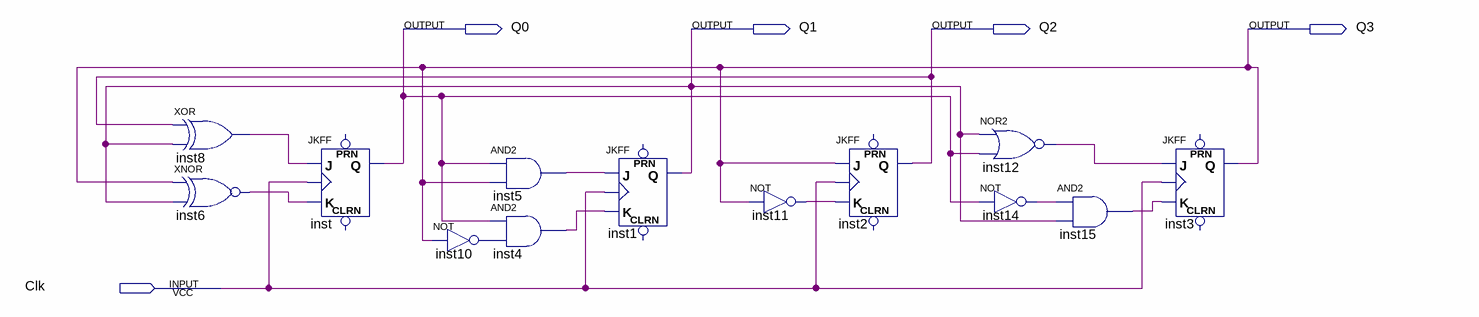
[diagram p0: schematic sheet]
// Quartus schematic Counter.bdf as structural Verilog: 13 symbols, 5 pins
module Counter (
  input  Clk,
  output Q0,
  output Q1,
  output Q2,
  output Q3
);

  wire inst4_out, inst5_out, inst6_out, inst8_out, inst10_out, inst11_out, inst12_out, inst14_out, inst15_out;

  xor inst8 (inst8_out, Q2, Q1);
  xnor inst6 (inst6_out, Q3, Q1);
  JKFF inst (.K(inst6_out), .J(inst8_out), .CLK(Clk), .Q(Q0));  // open: PRN, CLRN
  and inst5 (inst5_out, Q0, Q3);
  and inst4 (inst4_out, Q0, inst10_out);
  not inst10 (inst10_out, Q3);
  JKFF inst1 (.K(inst4_out), .J(inst5_out), .CLK(Clk), .Q(Q1));  // open: PRN, CLRN
  not inst11 (inst11_out, Q3);
  JKFF inst2 (.K(inst11_out), .J(Q3), .CLK(Clk), .Q(Q2));  // open: PRN, CLRN
  nor inst12 (inst12_out, Q1, Q0);
  not inst14 (inst14_out, Q0);
  and inst15 (inst15_out, inst14_out, Q1);
  JKFF inst3 (.K(inst15_out), .J(inst12_out), .CLK(Clk), .Q(Q3));  // open: PRN, CLRN
endmodule
